# Altium schematic sheet [01] COVER PAGE.SchDoc: SmartIMU
size A4; Author: Hom; CompanyName: KitSprout; DrawnBy: Hom; Engineer: Hom; Organization: KitSprout; Revision: A; SheetNumber: 1; SheetTotal: 7; Version: v2.0; LibVersion: v3.5
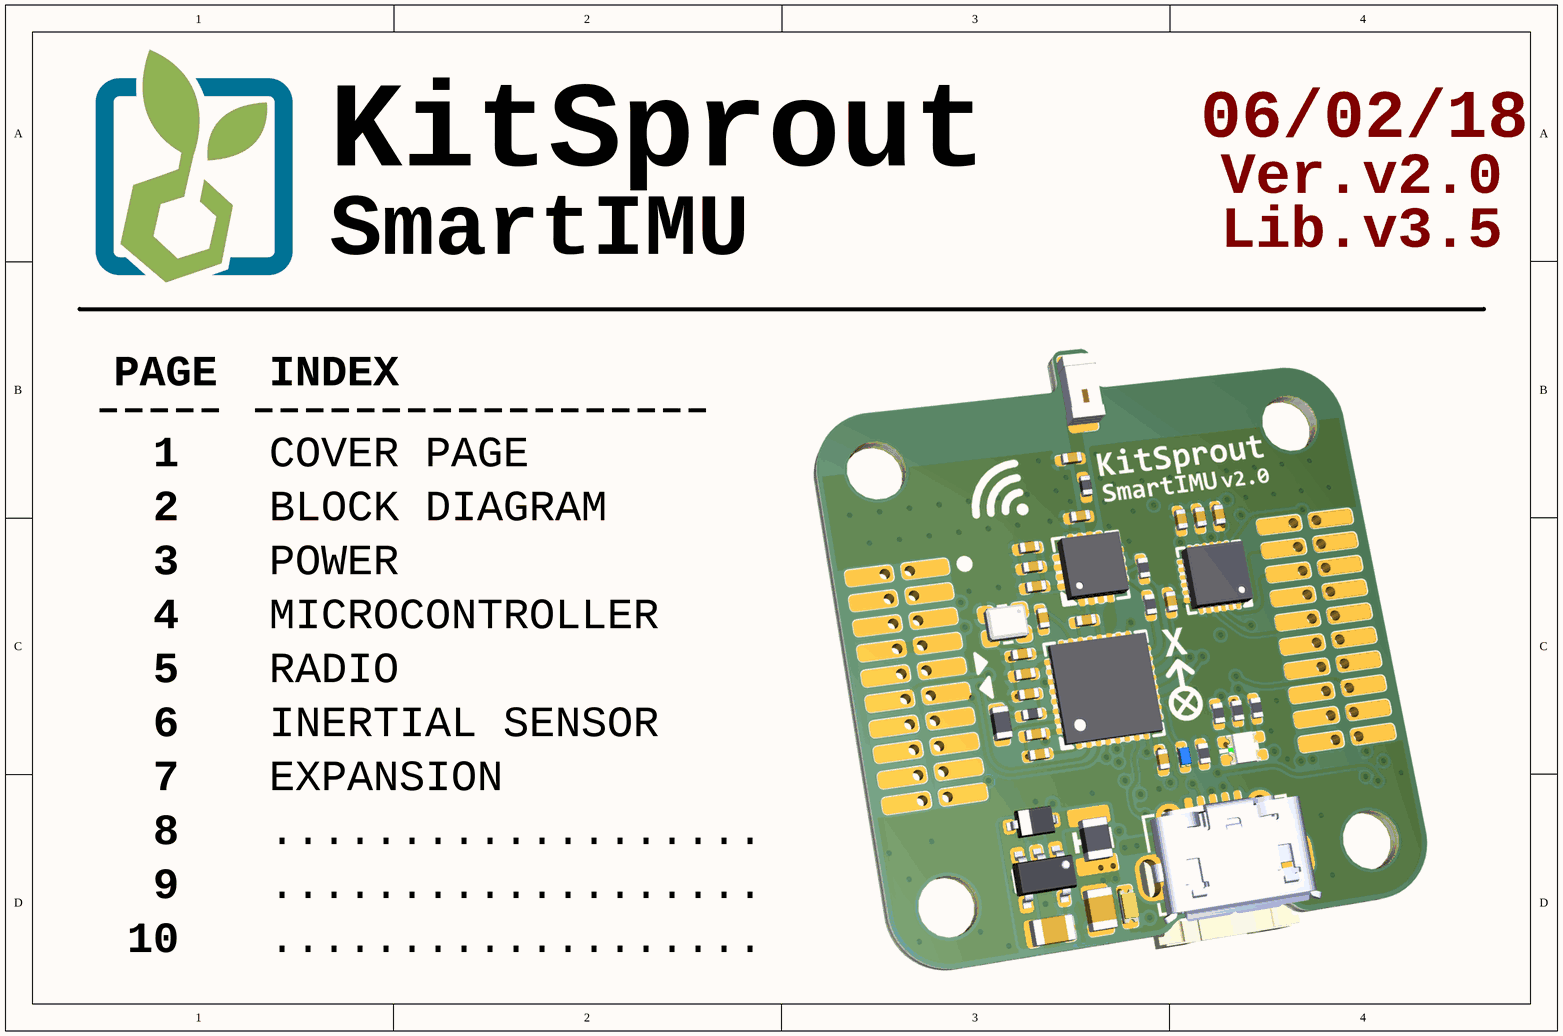
[diagram p0: [01] COVER PAGE.SchDoc]

## Notes on the sheet
- 06/02/18
- Ver.
- Lib.
- PAGE
- INDEX
- 1
- COVER PAGE
- 2
- 3
- BLOCK DIAGRAM
- POWER
- 4
- MICROCONTROLLER
- 5
- RADIO
- 6
- INERTIAL SENSOR
- 7
- 8
- EXPANSION
- ...................
- 9
- 10